# Altium schematic sheet Sheet5.SchDoc
size B
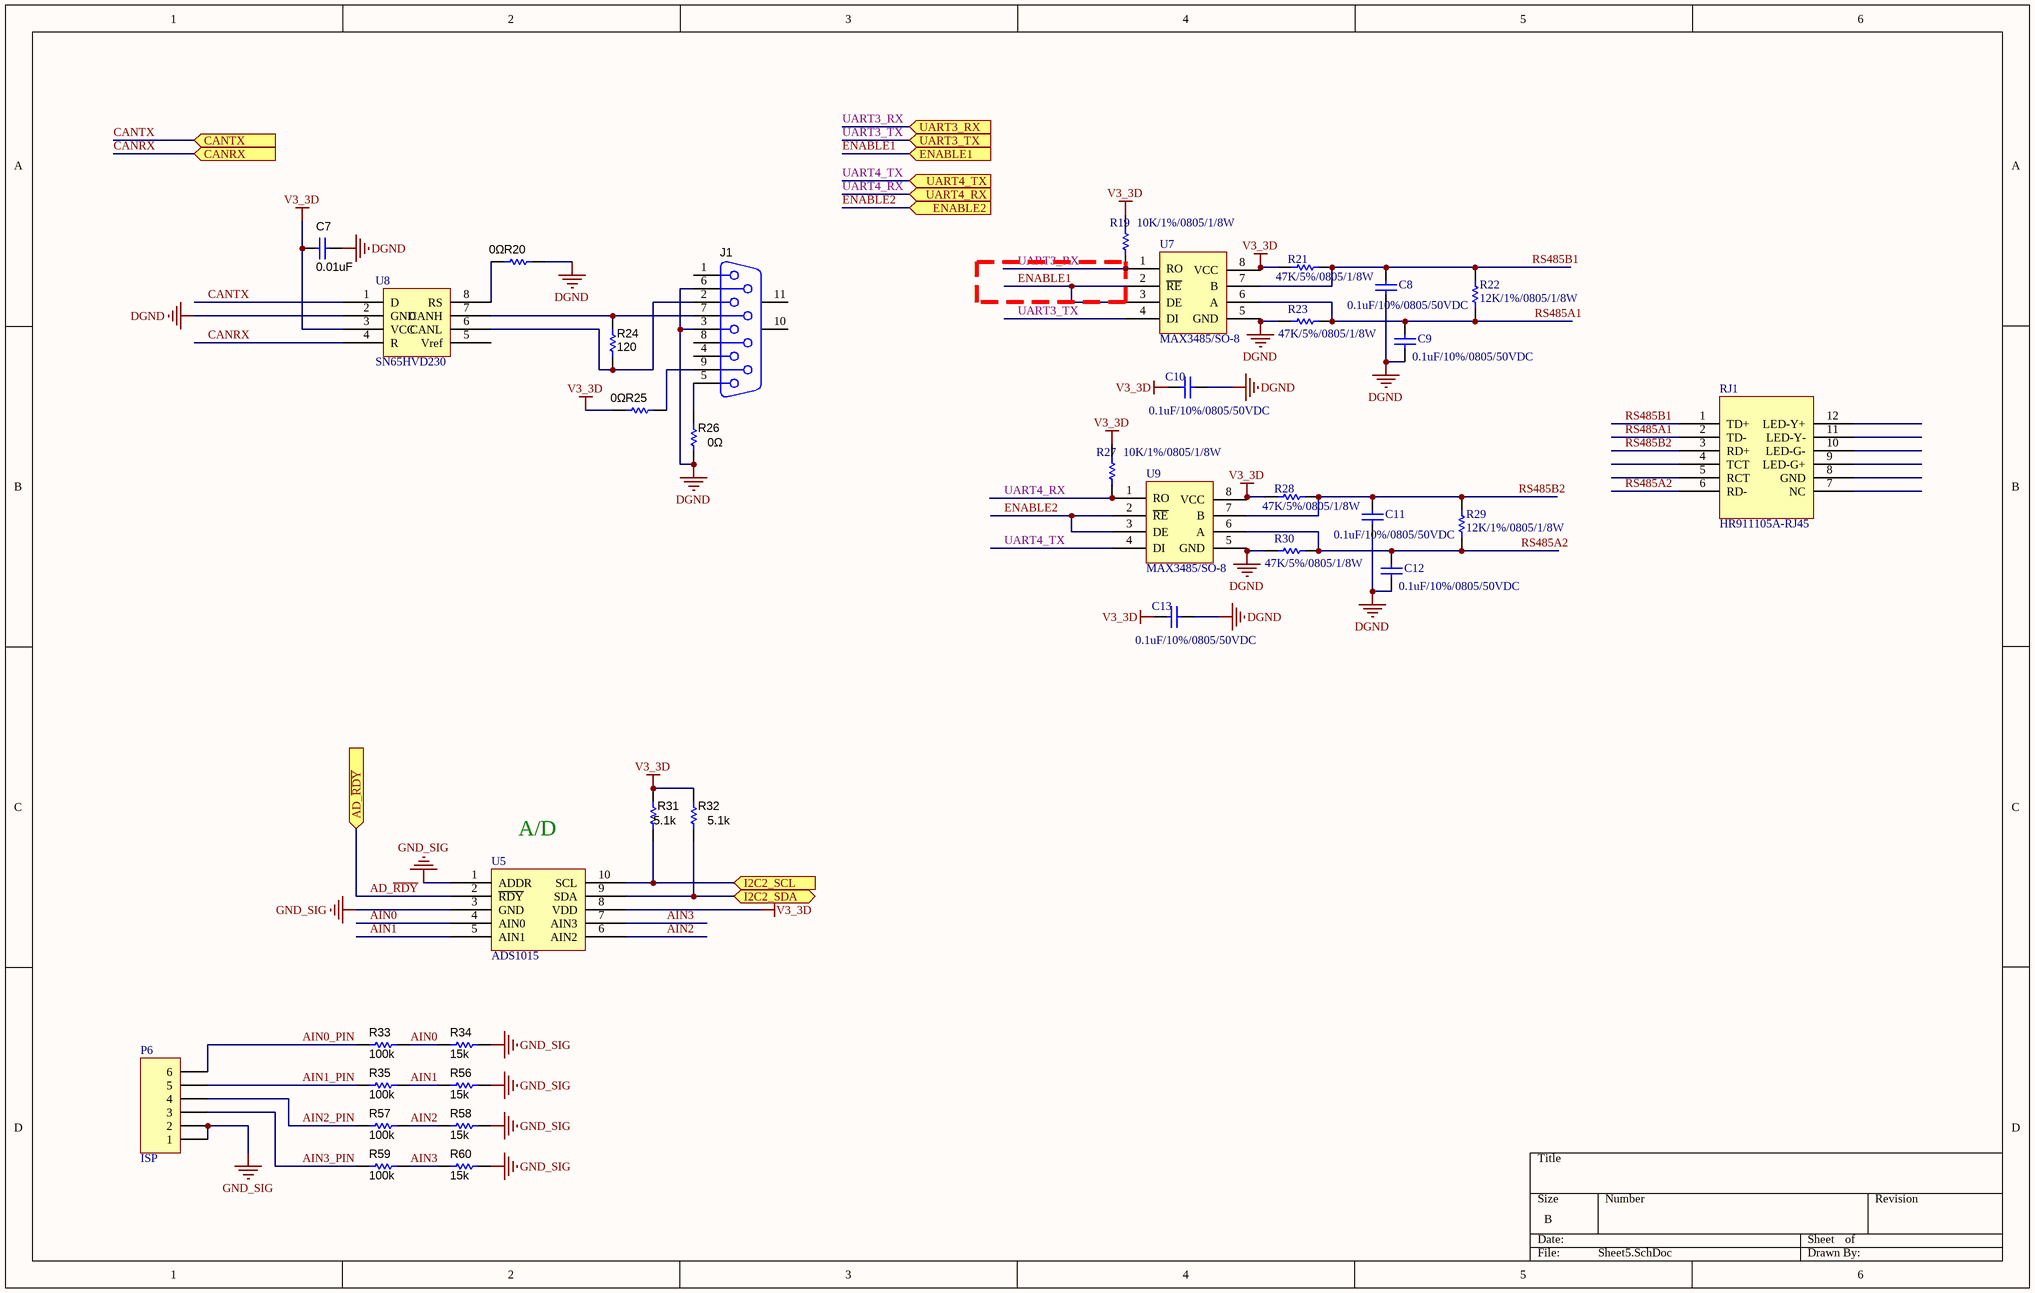
[diagram p0: Sheet5.SchDoc]

## Parts
C7  0.01uF  [0805_cap]
C8  0.1uF/10%/0805/50VDC  [0805_cap]
C9  0.1uF/10%/0805/50VDC  [0805_cap]
C10  0.1uF/10%/0805/50VDC  [0805_cap]
C11  0.1uF/10%/0805/50VDC  [0805_cap]
C12  0.1uF/10%/0805/50VDC  [0805_cap]
C13  0.1uF/10%/0805/50VDC  [0805_cap]
J1  (no value)  [CONN_1734348-1]
P6  ISP  [SIP-6B]
R19  10K/1%/0805/1/8W  [0805]
R20  0Ω  [0805]
R21  47K/5%/0805/1/8W  [0805]
R22  12K/1%/0805/1/8W  [0805]
R23  47K/5%/0805/1/8W  [0805]
R24  value 120  [0805]  (hidden comment: 120Ω)
R25  0Ω  [0805]
R26  0Ω  [0805]
R27  10K/1%/0805/1/8W  [0805]
R28  47K/5%/0805/1/8W  [0805]
R29  12K/1%/0805/1/8W  [0805]
R30  47K/5%/0805/1/8W  [0805]
R31  5.1k  [0805]
R32  5.1k  [0805]
R33  value 100k  [0805]  (hidden comment: CRCW080560R4FKEA)
R34  value 15k  [0805]  (hidden comment: CRCW080560R4FKEA)
R35  value 100k  [0805]  (hidden comment: CRCW080560R4FKEA)
R56  value 15k  [0805]  (hidden comment: CRCW080560R4FKEA)
R57  value 100k  [0805]  (hidden comment: CRCW080560R4FKEA)
R58  value 15k  [0805]  (hidden comment: CRCW080560R4FKEA)
R59  value 100k  [0805]  (hidden comment: CRCW080560R4FKEA)
R60  value 15k  [0805]  (hidden comment: CRCW080560R4FKEA)
RJ1  HR911105A-RJ45  [HR911105A]
U5  ADS1015  [MUB10A_N]
U7  MAX3485/SO-8  [SO-G8]
U8  SN65HVD230  [SO-G8]
U9  MAX3485/SO-8  [SO-G8]

## Ports
AD_~{RDY} (in), CANRX (in), CANTX (in), ENABLE1 (in), ENABLE2 (in), I2C2_SCL (in), I2C2_SDA (bidir), UART3_RX (in), UART3_TX (in), UART4_RX (in), UART4_TX (in)

## Nets
DGND: C7.2 C8.1 C9.1 C10.2 C11.1 C12.1 C13.2 J1.3 J1.6 R20.2 R23.2 R26.1 R30.2 U7.5(GND) U8.2(GND) U9.5(GND)
GND_SIG: P6.1 P6.2 R34.2 R56.2 R58.2 R60.2 U5.1(ADDR) U5.3(GND)
V3_3D: C7.1 C10.1 C13.1 R19.2 R21.2 R25.1 R27.2 R28.2 R31.1 R32.1 U5.8(VDD) U7.8(VCC) U8.3(VCC) U9.8(VCC)
AD_~{RDY}: U5.2(~{RDY}) ; port AD_~{RDY}
AIN0: R33.2 R34.1 U5.4(AIN0)
AIN0_PIN: P6.6 R33.1
AIN1: R35.2 R56.1 U5.5(AIN1)
AIN1_PIN: P6.5 R35.1
AIN2: R57.2 R58.1 U5.6(AIN2)
AIN2_PIN: P6.4 R57.1
AIN3: R59.2 R60.1 U5.7(AIN3)
AIN3_PIN: P6.3 R59.1
CANRX: U8.4(R) ; port CANRX
CANTX: U8.1(D) ; port CANTX
ENABLE1: U7.2(~{RE}) U7.3(DE) ; port ENABLE1
ENABLE2: U9.2(~{RE}) U9.3(DE) ; port ENABLE2
I2C2_SCL: R31.2 U5.10(SCL) ; port I2C2_SCL
I2C2_SDA: R32.2 U5.9(SDA) ; port I2C2_SDA
RS485A1: C9.2 R22.1 R23.1 RJ1.2(TD-) U7.6(A)
RS485A2: C12.2 R29.1 R30.1 RJ1.6(RD-) U9.6(A)
RS485B1: C8.2 R21.1 R22.2 RJ1.1(TD+) U7.7(B)
RS485B2: C11.2 R28.1 R29.2 RJ1.3(RD+) U9.7(B)
UART3_RX: R19.1 U7.1(RO) ; port UART3_RX
UART3_TX: U7.4(DI) ; port UART3_TX
UART4_RX: R27.1 U9.1(RO) ; port UART4_RX
UART4_TX: U9.4(DI) ; port UART4_TX
NetJ1_2: J1.2 R24.2 U8.6(CANL)
NetJ1_5: J1.5 R26.2
NetJ1_7: J1.7 R24.1 U8.7(CANH)
NetJ1_9: J1.9 R25.2
NetR20_1: R20.1 U8.8(RS)

Not connected (* = marked no-connect by the designer): J1 1 4 8 10(MH1) 11(MH2); RJ1 4(TCT) 5(RCT) 7(NC) 8(GND) 9(LED-G+) 10(LED-G-) 11(LED-Y-) 12(LED-Y+); U8 5(Vref)

## Notes on the sheet
- (near U5) A/D

## Library data of the parts
C7 = C1005X7R1C103K: CAP, CERM, 0.01uF, 16V, +/-10%, X7R, 0402; Manufacturer: TDK; Polarized: N; CompType: Capacitor; U/M: EA; Cap_F: 0.00000001; Tolerance_%: 10; ESR_Ohm: 0.0623; Value1: 0.0623 ohm; VDC_V: 16; TaMin_C: -55; TaMax_C: 125; Cap_Case: 0402; SymbolVersion: 2008-07-09; Value: 0.01uF; PartNumber: C1005X7R1C103K; ValueDisplayed: 0.01uF; PackageReference: 0402; RoHS: Y; Value2: 16V; MountType: SMT; Technology: Ceramic; Published: 2008-06-19; Publisher: Texas Instruments; LatestRevisionDate: 2013-04-19; LatestRevisionNote: Changed publisher; ComponentLink1Description: Datasheet link; ComponentLink1URL: http://www.tdk.co.jp/tefe02/e412_c.pdf; Supplier 1: Digi-Key; Supplier Part Number 1: 445-1262-1-ND; Supplier 2: Farnell; Supplier Part Number 2: 1844125
C8-C13 = ASC-0024CA: 名称: 贴片电容; 型号: CGA4J2X8R1H104K125AA; 品牌: TDK; 规格: 0.1uF/10%/0805/50VDC
J1 = 1734348-1: Conn D-SUB RCPT R/A 9POS GOLD/FL, TH; Manufacturer: TE Connectivity; SymbolCreator: a0412235; CompType: Connector; U/M: EA; SymbolVersion: 2012-11-29; PartNumber: 1734348-1; RoHS: Y; PackageReference: D-SUB 9 PIN; MountType: TH; ComponentLink1Description: Datasheet Link; ComponentLink1URL: http://www.te.com/commerce/DocumentDelivery/DDEController?Action=showdoc&DocId=Customer+Drawing%7F1734348%7FB1%7Fpdf%7FEnglish%7FENG_CD_1734348_B1.pdf%7F1734348-1; Publisher: Texas Instruments; LatestRevisionDate: 2013-04-26; Supplier 1: Digi-Key; Supplier Part Number 1: A35109-ND; Supplier 2: Mouser; Supplier Part Number 2: 571-1734348-1; Supplier 3: Farnell; Supplier Part Number 3: 2133699
P6 = Header 6: Header, 6-Pin; LatestRevisionDate: 17-Jul-2002; LatestRevisionNote: Re-released for DXP Platform.; Publisher: Altium Limited
R19 R27 = ASR-0030AA: Part Number: ASR-0028BA; 名称: 贴片电阻; 型号: RC0805FR-0710KL; 品牌: YAGEO; 规格: 10K/1%/0805/1/8W
R20 R25 = CRCW080560R4FKEA: RES, 0 ohm, 1%, 0.125W, 0805; Manufacturer: Vishay-Dale; CompType: Resistor; Value: 0R; Res_ohm: 60.4; Value_Code: 60R4; Tolerance_%: 1; Power_W: 0.125; VDC_V: 150; TempCo: 100 ppm/C; EIA_Code: E96; U/M: EA; SymbolVersion: 2009-05-29; PartNumber: CRCW080560R4FKEA; PackageReference: 0805; RoHS: Y; Value1: 1%; Value2: 0.125W; MountType: SMT; Technology: Thick Film; Published: 2008-06-26; Publisher: Texas Instruments; LatestRevisionDate: 2013-04-18; ComponentLink1Description: Datasheet link; ComponentLink1URL: http://www.vishay.com/docs/20035/dcrcwe3.pdf; Supplier 1: Digi-Key; Supplier Part Number 1: 541-60.4CCT-ND; Supplier 2: Mouser; Supplier Part Number 2: 71-CRCW0805-60.4-E3; Supplier 3: Farnell; Supplier Part Number 3: 1469951
R21 R23 R28 R30 = ASR-0134BA: 名称: 贴片电阻; 型号: RC0805JR-0747KL; 品牌: YAGEO; Part Number: ASR-0134BA; 规格: 47K/5%/0805/1/8W
R22 R29 = ASR-0028BA: 名称: 贴片电阻; 品牌: YAGEO; 规格: 12K/1%/0805/1/8W
R24 R31-R35 R56-R60 = CRCW080560R4FKEA: RES, 120ohm, 1%, 0.125W, 0805; Manufacturer: Vishay-Dale; CompType: Resistor; Res_ohm: 60.4; Value_Code: 60R4; Tolerance_%: 1; Power_W: 0.125; VDC_V: 150; TempCo: 100 ppm/C; EIA_Code: E96; U/M: EA; SymbolVersion: 2009-05-29; PartNumber: CRCW080560R4FKEA; PackageReference: 0805; RoHS: Y; Value1: 1%; Value2: 0.125W; MountType: SMT; Technology: Thick Film; Published: 2008-06-26; Publisher: Texas Instruments; LatestRevisionDate: 2013-04-18; ComponentLink1Description: Datasheet link; ComponentLink1URL: http://www.vishay.com/docs/20035/dcrcwe3.pdf; Supplier 1: Digi-Key; Supplier Part Number 1: 541-60.4CCT-ND; Supplier 2: Mouser; Supplier Part Number 2: 71-CRCW0805-60.4-E3; Supplier 3: Farnell; Supplier Part Number 3: 1469951
  R31 R32: Value: 5.1k
R26 = CRCW080560R4FKEA: RES, 0 ohm, 1%, 0.125W, 0805; Manufacturer: Vishay-Dale; CompType: Resistor; Res_ohm: 60.4; Value_Code: 60R4; Tolerance_%: 1; Power_W: 0.125; VDC_V: 150; TempCo: 100 ppm/C; EIA_Code: E96; U/M: EA; SymbolVersion: 2009-05-29; Value: 0Ω; PartNumber: CRCW080560R4FKEA; PackageReference: 0805; RoHS: Y; Value1: 1%; Value2: 0.125W; MountType: SMT; Technology: Thick Film; Published: 2008-06-26; Publisher: Texas Instruments; LatestRevisionDate: 2013-04-18; ComponentLink1Description: Datasheet link; ComponentLink1URL: http://www.vishay.com/docs/20035/dcrcwe3.pdf; Supplier 1: Digi-Key; Supplier Part Number 1: 541-60.4CCT-ND; Supplier 2: Mouser; Supplier Part Number 2: 71-CRCW0805-60.4-E3; Supplier 3: Farnell; Supplier Part Number 3: 1469951
U7 U9 = MAX485: 名称: 485通讯; 规格: SO-8; 型号: MAX3485; 品牌: *; Part Number: *